# EasyEDA schematic EasyEDA.json
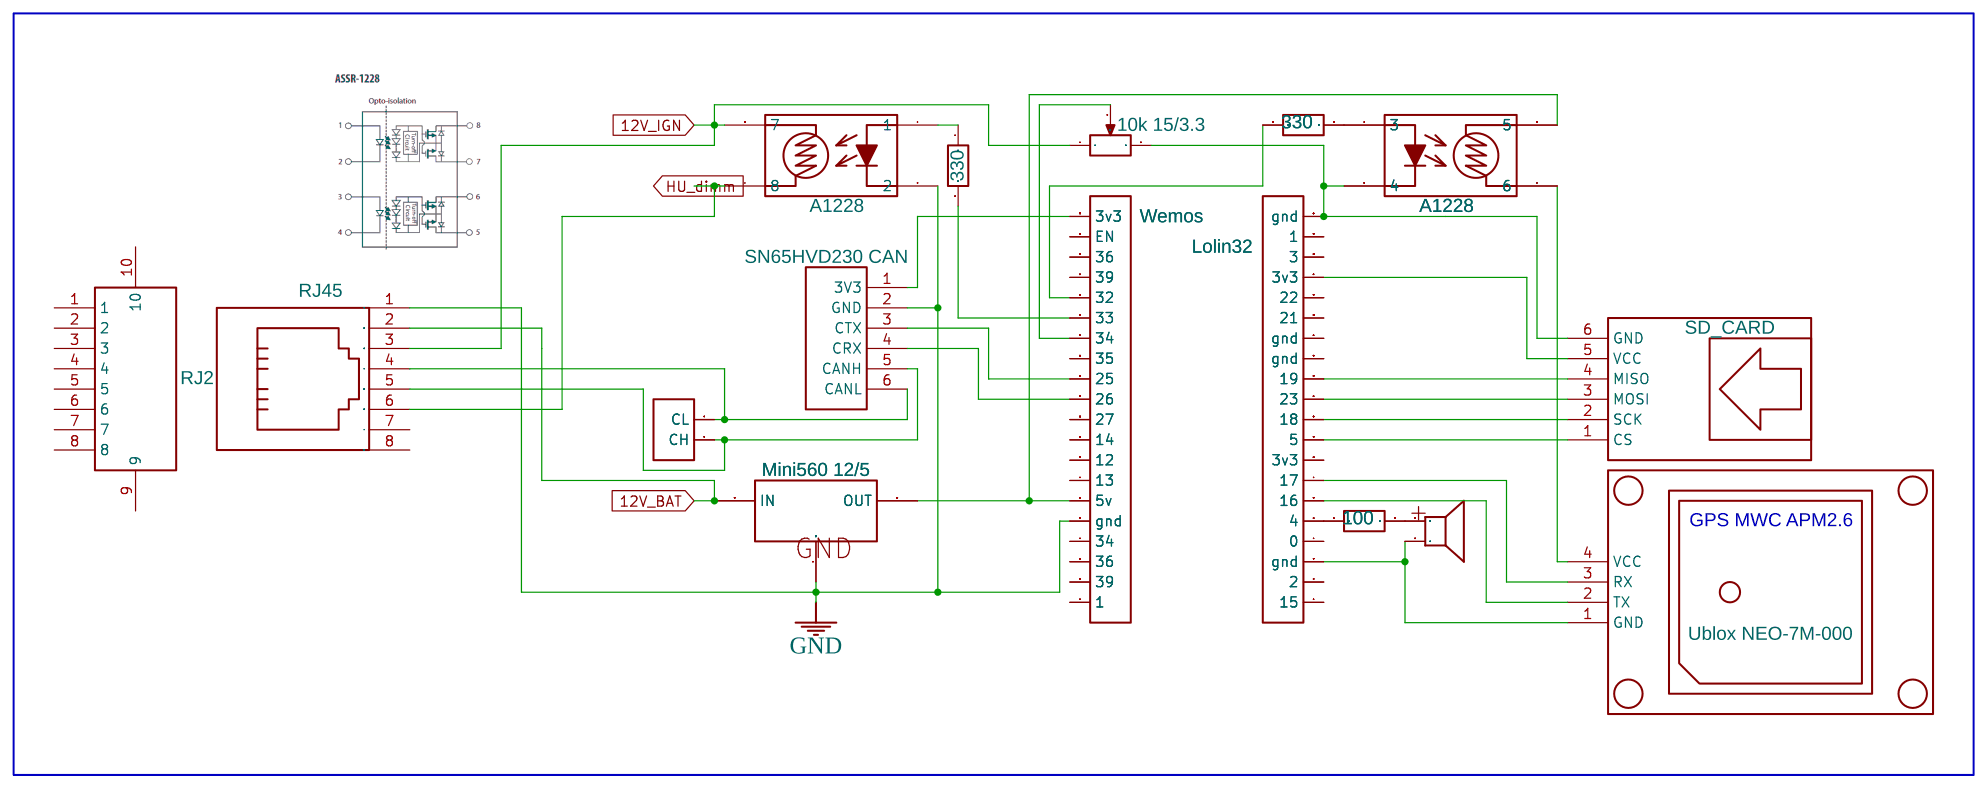
[diagram p0: schematic sheet]

## Parts
B2  Ublox NEO-7M-000  [GY-GPS6MV2GPSMODUL]
BUZ1  BUZZER_C9900210808  [BUZ-TH_BD12.5-P5.00-D0.8-RD]
H7  Wemos  [HDR-F-2.54_1X20]
H8  Lolin32  [HDR-F-2.54_1X20]
H9  HDR-F-2.54_1x2  [HDR-F-2.54_1X2]
R3  330  [R0603]
R45  330  [R0603]
R50  100  [R0603]
RJ2  6339160-1  [RJ45-SMD_6339160-1]
RJ3  RJ45  [RJ45-TH_FRJ45031-1100K6K0200]
RP6  10k 15/3.3  [RES-ADJ-TH_3386P]
U9  Mini560 12/5  [TO-252-2_L6.6-W6.1-P4.57-LS9.9-BR-CW]
U12  A1228  [OPTOISOLATOR PHOTOCELL OPTOCOUPLER]
U14  SD_CARD  [SD_CARD_ADAPTER]
U15  SN65HVD230 CAN  [SN65HVD230 CAN]
U17  A1228  [OPTOISOLATOR PHOTOCELL OPTOCOUPLER]

## Library data of the parts
B2 = Cheap GPS: Contributor: bato22
BUZ1 = BUZZER_C9900210808: Supplier: LCSC; Supplier Part: C9900210808; Manufacturer: null; Manufacturer Part: Buzzer; JLCPCB Part Class: Extended Part; Contributor: lcsc
H7 = HDR-F-2.54_1x20: Supplier Part: C50984; Supplier: LCSC; Contributor: LCEDA_Lib; Package Display: No
H8 = HDR-F-2.54_1x20: Supplier Part: C50984; Supplier: LCSC; Contributor: LCEDA_Lib
H9 = HDR-F-2.54_1x2: Supplier Part: C49661; Supplier: LCSC; Contributor: LCEDA_Lib
R3 R45 R50 = R_0603_EU: Contributor: LCEDA_Lib
RJ2 = 6339160-1: Contributor: LCSC; Supplier: LCSC; Supplier Part: C125076; Manufacturer: TE Connectivity(美国泰科); JLCPCB Part Class: Extended Part; link: https://lcsc.com/eda_search?q=C125076&%26type=1&ref=editor
RJ3 = FRJ45031-1100K6K0200: Contributor: LCSC; Supplier: LCSC; Supplier Part: C456375; Manufacturer: TXGA(特思嘉); JLCPCB Part Class: Extended Part; link: https://lcsc.com/eda_search?q=C456375&%26type=1&ref=editor
RP6 = R_3386P_EU: Supplier: LCSC; Contributor: LCEDA_Lib; Value(Ω): 10K
U9 = 7809(TO-252): Supplier: LCSC; Manufacturer: KEC; Manufacturer Part: KIA7809AF-RTF/P; Supplier Part: C69756; Paste Type: expand; Contributor: LCEDA_Lib
U12 U17 = Optoisolator Photocell: Contributor: MayaElectronicas
U14 = SD_CARD_ADAPTER: Supplier: SIGMA Electronica; Supplier Part: SIG0104; Contributor: Danilo Garcia-Hansen
U15 = SN65HVD230 CAN: Manufacturer Part: CAN; Contributor: smersh

## Nets
12V_BAT: RJ3.2 U9.in+(IN)
12V_IGN: RJ3.3 RP6.1 U17.3(7)
GND: H7.5(gnd) RJ3.1 U9.l(GND) U15.2(GND) U17.2
Net-(B2-1): B2.1(GND) BUZ1.1 H8.3(gnd)
Net-(B2-2): B2.2(TX) H8.6(16)
Net-(B2-3): B2.3(RX) H8.7(17)
Net-(B2-4): B2.4(VCC) U12.4(6)
Net-(BUZ1-2): BUZ1.2 R50.2
Net-(H7-6): H7.6(5v) U9.out+(OUT) U12.3(5)
Net-(H7-11): H7.11(26) U15.4(CRX)
Net-(H7-12): H7.12(25) U15.3(CTX)
Net-(H7-14): H7.14(34) RP6.2
Net-(H7-15): H7.15(33) R45.2
Net-(H7-16): H7.16(32) R3.1
Net-(H7-20): H7.20(3v3) U15.1(3V3)
Net-(H8-5): H8.5(4) R50.1
Net-(H8-9): H8.9(5) U14.1(CS)
Net-(H8-10): H8.10(18) U14.2(SCK)
Net-(H8-11): H8.11(23) U14.3(MOSI)
Net-(H8-12): H8.12(19) U14.4(MISO)
Net-(H8-17): H8.17(3v3) U14.5(VCC)
Net-(H8-20): H8.20(gnd) RP6.3 U12.2(4) U14.6(GND)
Net-(H9-1): H9.1(CH) RJ3.5 U15.5(CANH)
Net-(H9-2): H9.2(CL) RJ3.4 U15.6(CANL)
Net-(R3-2): R3.2 U12.1(3)
Net-(R45-1): R45.1 U17.1
Net-(RJ3-6): RJ3.6 U17.4(8)

Not connected (* = marked no-connect by the designer): H7 1 2(39) 3(36) 4(34) 7(13) 8(12) 9(14) 10(27) 13(35) 17(39) 18(36) 19(EN); H8 1(15) 2 4(0) 8(3v3) 13(gnd) 14(gnd) 15(21) 16(22) 18(3) 19(1); RJ2 1 2 3 4 5 6 7 8 9 10; RJ3 7 8

## Notes on the sheet
- GPS MWC APM2.6
